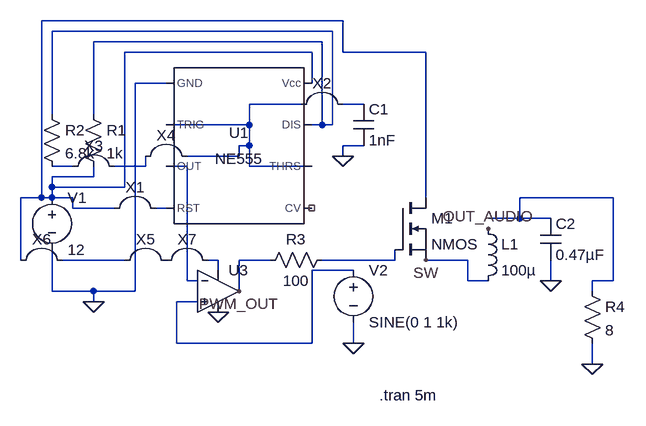
[diagram p0: schematic ClassD_Amplifier_kunal.asc.asc]
ClassD_Amplifier_kunal.asc.asc, the LTspice schematic file:
Version 4
SHEET 1 880 800
WIRE 176 32 -288 32
WIRE 160 48 -272 48
WIRE 144 64 -208 64
WIRE 128 80 -160 80
WIRE 176 80 176 32
WIRE 304 80 176 80
WIRE -96 128 -144 128
WIRE 128 128 128 80
WIRE 112 160 32 160
WIRE 208 160 176 160
WIRE -272 176 -272 48
WIRE -208 176 -208 64
WIRE 32 192 32 160
WIRE 32 192 -96 192
WIRE 144 192 144 64
WIRE 144 192 128 192
WIRE 160 192 160 48
WIRE 160 192 144 192
WIRE 32 224 32 192
WIRE 32 224 16 224
WIRE 208 224 176 224
WIRE 16 240 16 224
WIRE 16 240 -64 240
WIRE 176 240 176 224
WIRE -240 256 -272 256
WIRE -128 256 -128 240
WIRE -128 256 -176 256
WIRE -64 256 -96 256
WIRE 32 256 32 224
WIRE 128 256 32 256
WIRE -208 272 -208 256
WIRE -208 272 -272 272
WIRE -272 288 -272 272
WIRE -160 288 -160 80
WIRE -160 288 -272 288
WIRE -288 304 -288 32
WIRE -288 304 -320 304
WIRE -272 304 -272 288
WIRE -272 304 -288 304
WIRE -240 304 -272 304
WIRE 304 304 304 80
WIRE 592 304 448 304
WIRE -240 320 -240 304
WIRE -176 320 -240 320
WIRE -96 320 -112 320
WIRE 448 336 448 304
WIRE 448 336 400 336
WIRE 496 336 448 336
WIRE -320 400 -320 304
WIRE -160 400 -256 400
WIRE -16 400 -32 400
WIRE 64 400 16 400
WIRE 256 400 256 384
WIRE 256 400 144 400
WIRE 368 400 304 400
WIRE -16 416 -16 400
WIRE 192 416 128 416
WIRE -64 432 -64 256
WIRE -48 432 -64 432
WIRE 368 432 368 400
WIRE 400 432 368 432
WIRE 496 432 496 400
WIRE 592 432 592 304
WIRE 592 432 560 432
WIRE -272 448 -272 384
WIRE -208 448 -272 448
WIRE -144 448 -144 128
WIRE -144 448 -208 448
WIRE 16 448 16 400
WIRE 560 448 560 432
WIRE -208 464 -208 448
WIRE -48 464 -80 464
WIRE -80 528 -80 464
WIRE 128 528 128 416
WIRE 128 528 -80 528
WIRE 192 528 192 496
WIRE 560 560 560 528
FLAG -208 464 0
FLAG 176 240 0
FLAG 192 528 0
FLAG -16 480 0
FLAG 16 448 PWM_OUT
FLAG 304 400 SW
FLAG 400 352 OUT_AUDIO
FLAG 496 432 0
FLAG 560 560 0
SYMBOL voltage -272 288 R0
WINDOW 123 0 0 Left 0
WINDOW 39 0 0 Left 0
SYMATTR InstName V1
SYMATTR Value 12
SYMBOL Misc\\NE555 16 224 R0
SYMATTR InstName U1
SYMBOL res -224 160 R0
SYMATTR InstName R1
SYMATTR Value 1k
SYMBOL res -288 160 R0
SYMATTR InstName R2
SYMATTR Value 6.8k
SYMBOL cap 192 160 R0
SYMATTR InstName C1
SYMATTR Value 1nF
SYMBOL Misc\\jumper -144 256 R0
SYMATTR InstName X1
SYMBOL Misc\\jumper 144 96 R0
SYMATTR InstName X2
SYMBOL Misc\\jumper -208 192 R0
SYMATTR InstName X3
SYMBOL Misc\\jumper -96 176 R0
SYMATTR InstName X4
SYMBOL voltage 192 400 R0
SYMATTR InstName V2
SYMATTR Value SINE(0 1 1k)
SYMBOL OpAmps\\UniversalOpAmp2 -16 448 R0
SYMATTR InstName U3
SYMBOL Misc\\jumper -128 336 R0
SYMATTR InstName X5
SYMBOL Misc\\jumper -288 336 R0
SYMATTR InstName X6
SYMBOL Misc\\jumper -64 336 R0
SYMATTR InstName X7
SYMBOL nmos 256 304 R0
SYMATTR InstName M1
SYMBOL res 160 384 R90
WINDOW 0 0 56 VBottom 2
WINDOW 3 32 56 VTop 2
SYMATTR InstName R3
SYMATTR Value 100
SYMBOL ind 384 336 R0
SYMATTR InstName L1
SYMATTR Value 100µ
SYMBOL cap 480 336 R0
SYMATTR InstName C2
SYMATTR Value 0.47µF
SYMBOL res 544 432 R0
SYMATTR InstName R4
SYMATTR Value 8
TEXT 232 608 Left 2 !.tran 5m

The netlist it stands for:
* ClassD_Amplifier_kunal.asc.asc
V1 N001 0 12
XU1 0 N003 N004 N001 NC_01 N003 N002 N001 NE555  ; pins GND TRIG OUT RST CV THRS DIS Vcc
R1 N002 N001 1k
R2 N002 N003 6.8k
C1 N003 0 1nF
V2 N007 0 SINE(0 1 1k)
XU3 N007 N004 N001 0 PWM_OUT level2 Avol=1Meg GBW=10Meg Slew=10Meg Ilimit=25m Rail=0 Vos=0 En=0 Enk=0 In=0 Ink=0 Rin=500Meg  ; pins In+ In- V+ V- OUT
M1 N001 N006 SW SW NMOS
R3 N006 PWM_OUT 100
L1 OUT_AUDIO SW 100µ
C2 N005 0 0.47µF
R4 N005 0 8
.model NMOS NMOS
.model PMOS PMOS
.lib standard.mos
.tran 5m
.lib NE555.sub
.lib UniversalOpAmp2.lib
.backanno
.end